# Altium schematic sheet 小板原理图.SchDoc
size 685 x 355 mm; SheetNumber: 0; SheetTotal: 0
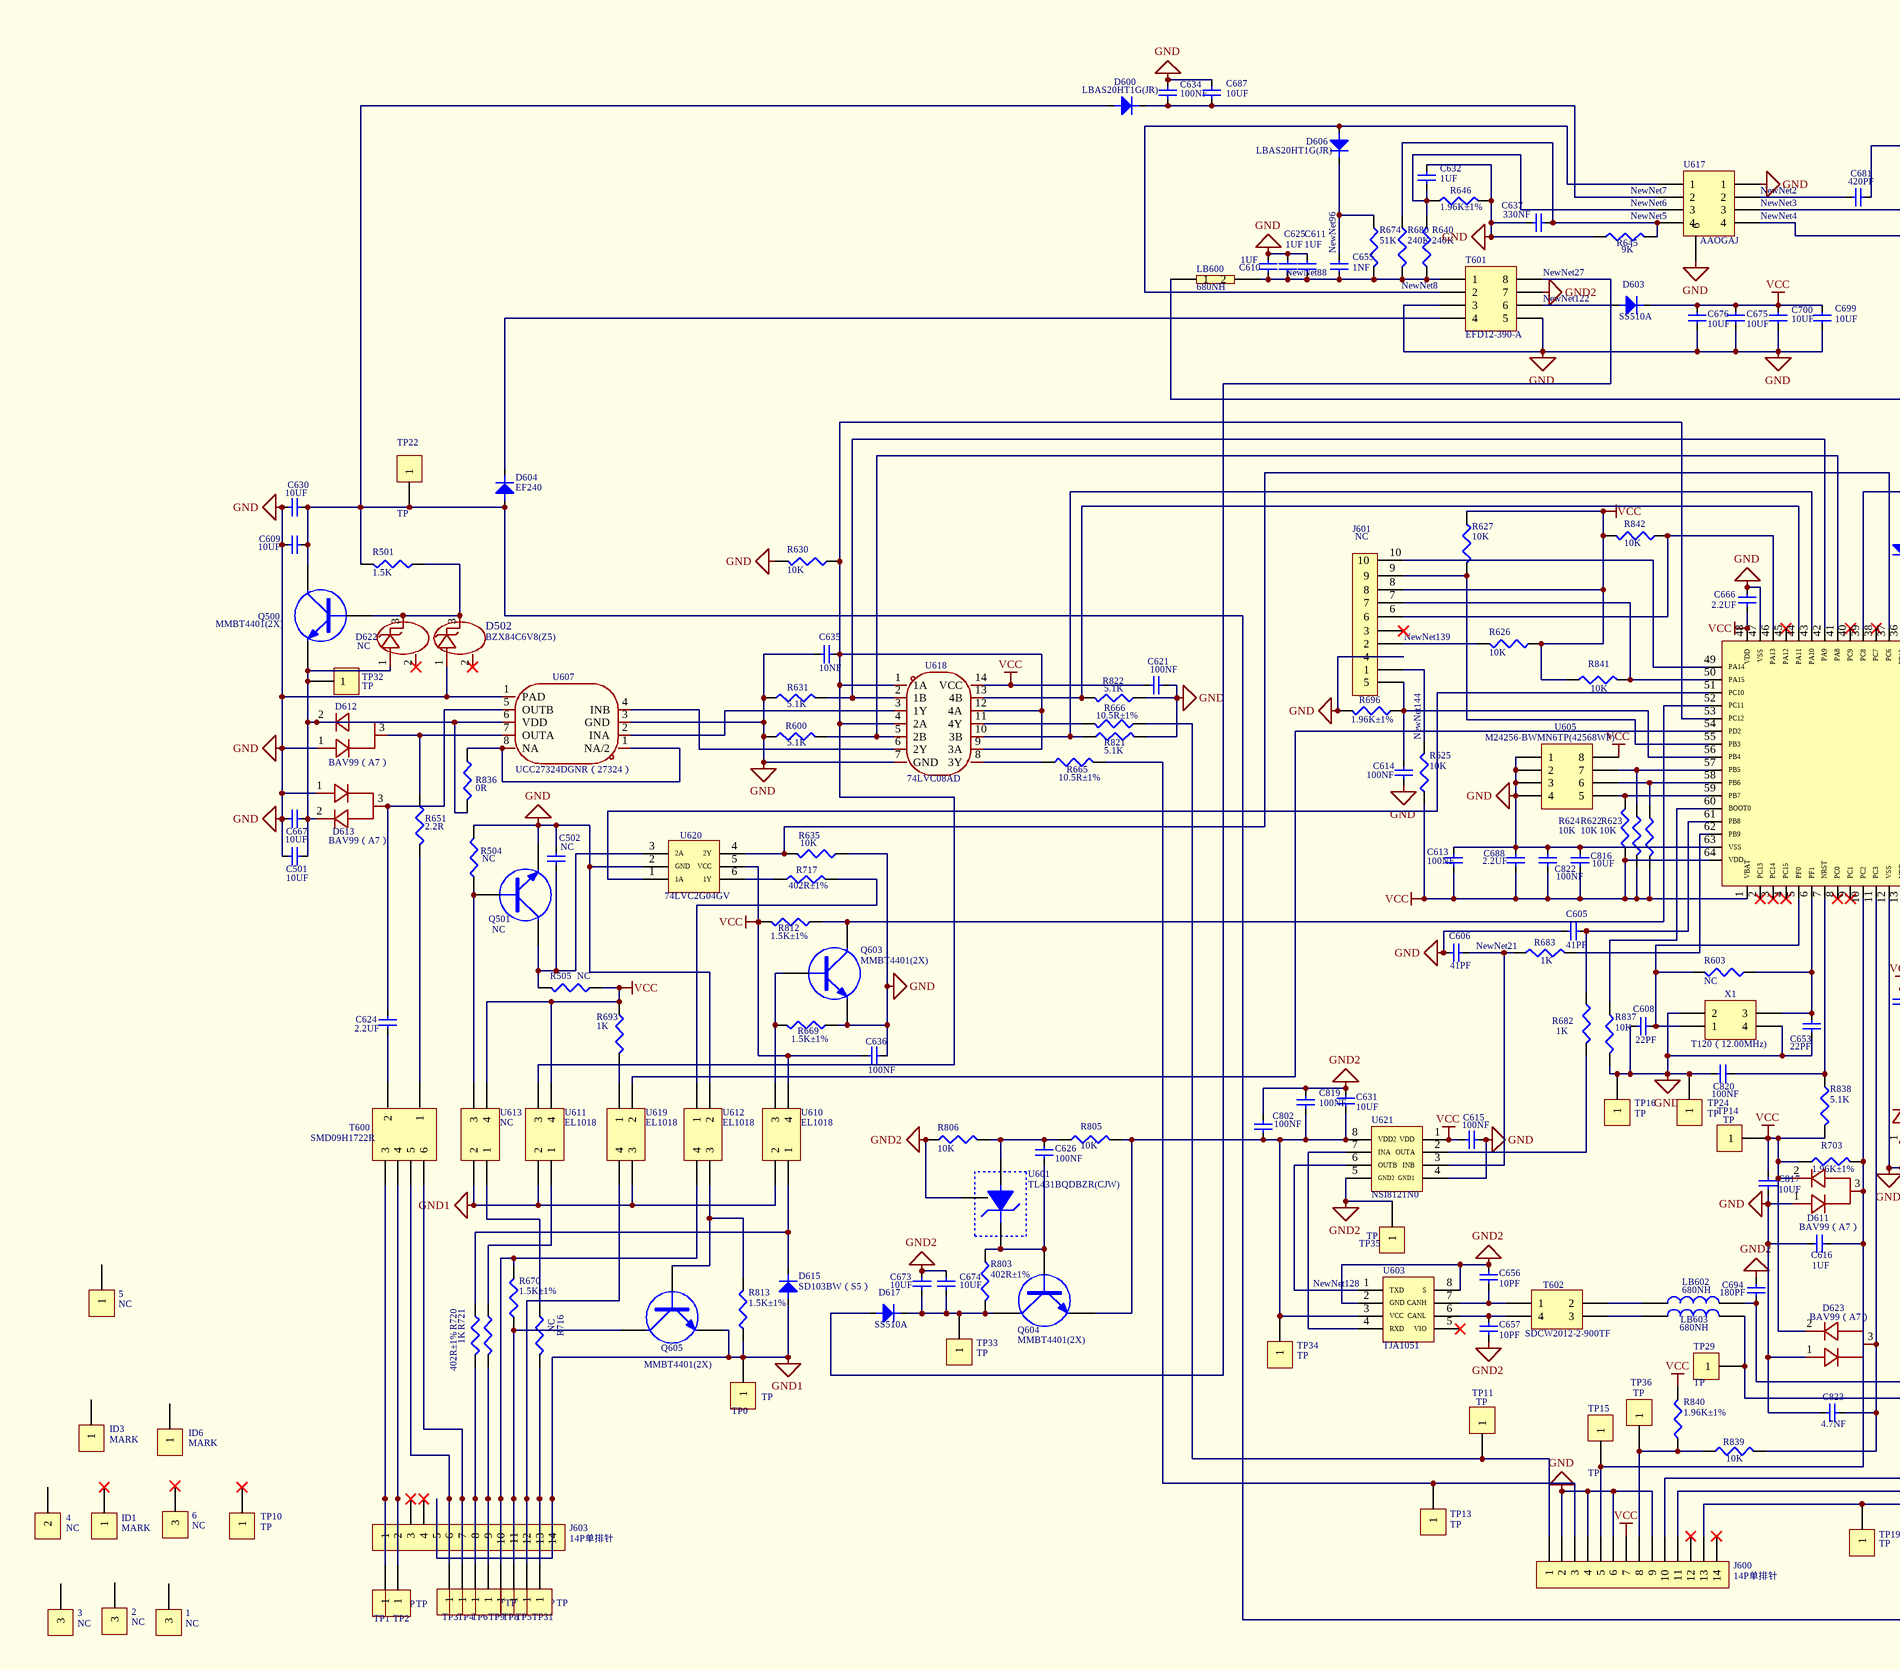
[diagram p0: 小板原理图.SchDoc, left]
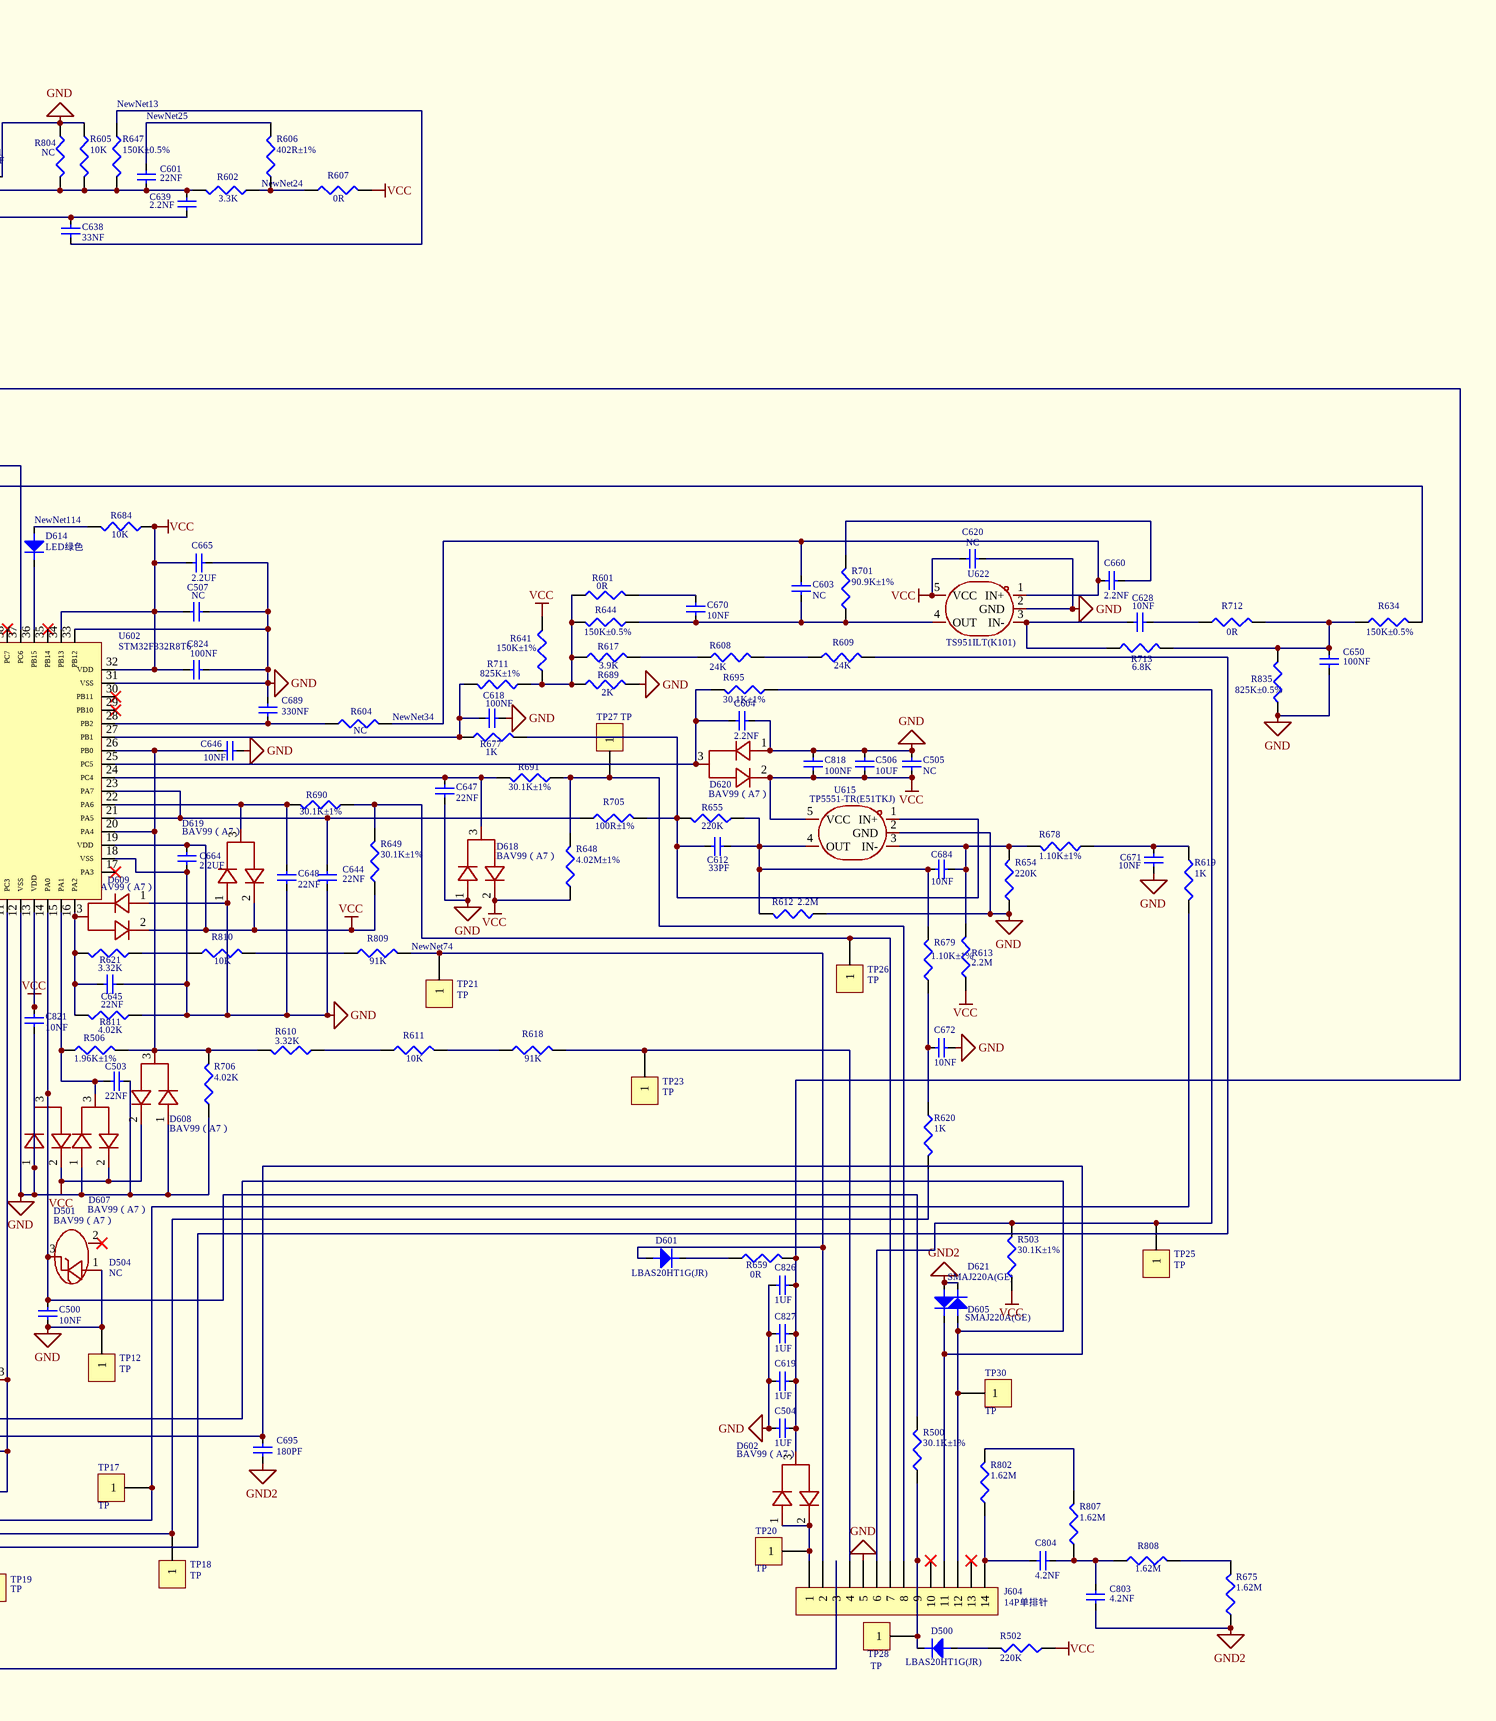
[diagram p1: 小板原理图.SchDoc, right]

## Parts
1  NC  [27]
2  NC  [28]
3  NC  [29]
4  NC  [30]
5  NC  [30]
6  NC  [30]
C500  10NF  [33]
C501  10UF  [4]
C502  NC  [33]
C503  22NF  [33]
C504  1UF  [3]
C505  NC  [3]
C506  10UF  [3]
C507  NC  [3]
C601  22NF  [33]
C603  NC  [33]
C604  2.2NF  [33]
C605  41PF  [33]
C606  41PF  [33]
C608  22PF  [14]
C609  10UF  [4]
C610  1UF  [3]
C611  1UF  [3]
C612  33PF  [33]
C613  100NF  [14]
C614  100NF  [14]
C615  100NF  [14]
C616  1UF  [33]
C618  100NF  [14]
C619  1UF  [32]
C620  NC  [14]
C621  100NF  [14]
C624  2.2UF  [3]
C625  1UF  [3]
C626  100NF  [14]
C628  10NF  [33]
C630  10UF  [4]
C631  10UF  [4]
C632  1UF  [32]
C634  100NF  [33]
C635  10NF  [33]
C636  100NF  [14]
C637  330NF  [32]
C638  33NF  [14]
C639  2.2NF  [33]
C644  22NF  [33]
C645  22NF  [33]
C646  10NF  [33]
C647  22NF  [33]
C648  22NF  [33]
C650  100NF  [33]
C653  22PF  [14]
C655  1NF  [4]
C656  10PF  [33]
C657  10PF  [33]
C660  2.2NF  [33]
C664  2.2UF  [32]
C665  2.2UF  [32]
C666  2.2UF  [32]
C667  10UF  [4]
C670  10NF  [33]
C671  10NF  [33]
C672  10NF  [33]
C673  10UF  [4]
C674  10UF  [4]
C675  10UF  [32]
C676  10UF  [32]
C681  420PF  [33]
C684  10NF  [33]
C687  10UF  [4]
C688  2.2UF  [32]
C689  330NF  [32]
C694  180PF  [33]
C695  180PF  [33]
C699  10UF  [32]
C700  10UF  [32]
C802  100NF  [14]
C803  4.2NF  [4]
C804  4.2NF  [4]
C816  10UF  [32]
C817  10UF  [32]
C818  100NF  [14]
C819  100NF  [14]
C820  100NF  [33]
C821  10NF  [33]
C822  100NF  [14]
C823  4.7NF  [33]
C824  100NF  [14]
C826  1UF  [32]
C827  1UF  [32]
D500  LBAS20HT1G(JR)  [18]
D501  BAV99（A7）  [31]
D502  BZX84C6V8(Z5)  [31]
D504  NC  [31]
D600  LBAS20HT1G(JR)  [18]
D601  LBAS20HT1G(JR)  [18]
D602  BAV99（A7）  [31]
D603  SS510A  [16]
D604  EF240  [17]
D605  SMAJ220A(GE)  [19]
D606  LBAS20HT1G(JR)  [18]
D607  BAV99（A7）  [31]
D608  BAV99（A7）  [31]
D609  BAV99（A7）  [31]
D611  BAV99（A7）  [31]
D612  BAV99（A7）  [31]
D613  BAV99（A7）  [31]
D614  LED绿色  [10]
D615  SD103BW（S5）  [18]
D617  SS510A  [16]
D618  BAV99（A7）  [31]
D619  BAV99（A7）  [31]
D620  BAV99（A7）  [31]
D621  SMAJ220A(GE)  [19]
D622  NC  [31]
D623  BAV99（A7）  [31]
ID1  MARK  [30]
ID3  MARK  [30]
ID6  MARK  [30]
J600  14P单排针  [21]
J601  NC  [25]
J603  14P单排针  [21]
J604  14P单排针  [21]
LB600  680NH  [3]
LB602  680NH  [32]
LB603  680NH  [32]
Q500  MMBT4401(2X)  [31]
Q501  NC  [31]
Q603  MMBT4401(2X)  [31]
Q604  MMBT4401(2X)  [31]
Q605  MMBT4401(2X)  [31]
R500  30.1K±1%  [33]
R501  1.5K  [32]
R502  220K  [33]
R503  30.1K±1%  [33]
R504  NC  [33]
R505  NC  [33]
R506  1.96K±1%  [33]
R600  5.1K  [33]
R601  0R  [33]
R602  3.3K  [33]
R603  NC  [32]
R604  NC  [33]
R605  10K  [33]
R606  402R±1%  [33]
R607  0R  [33]
R608  24K  [32]
R609  24K  [32]
R610  3.32K  [32]
R611  10K  [32]
R612  2.2M  [32]
R613  2.2M  [32]
R617  3.9K  [32]
R618  91K  [32]
R619  1K  [33]
R620  1K  [33]
R621  3.32K  [32]
R622  10K  [33]
R623  10K  [33]
R624  10K  [33]
R625  10K  [33]
R626  10K  [33]
R627  10K  [33]
R630  10K  [33]
R631  5.1K  [33]
R634  150K±0.5%  [33]
R635  10K  [33]
R640  240K  [32]
R641  150K±1%  [33]
R644  150K±0.5%  [33]
R645  9K  [33]
R646  1.96K±1%  [33]
R647  150K±0.5%  [33]
R648  4.02M±1%  [33]
R649  30.1K±1%  [33]
R651  2.2R  [4]
R654  220K  [33]
R655  220K  [33]
R659  0R  [4]
R665  10.5R±1%  [33]
R666  10.5R±1%  [33]
R669  1.5K±1%  [33]
R670  1.5K±1%  [33]
R674  51K  [4]
R675  1.62M  [4]
R677  1K  [33]
R678  1.10K±1%  [33]
R679  1.10K±1%  [33]
R680  240K  [32]
R682  1K  [33]
R683  1K  [33]
R684  10K  [33]
R689  2K  [32]
R690  30.1K±1%  [33]
R691  30.1K±1%  [33]
R693  1K  [33]
R695  30.1K±1%  [33]
R696  1.96K±1%  [33]
R701  90.9K±1%  [33]
R703  1.96K±1%  [33]
R705  100R±1%  [33]
R706  4.02K  [32]
R711  825K±1%  [33]
R712  0R  [33]
R713  6.8K  [33]
R716  NC  [33]
R717  402R±1%  [33]
R720  402R±1%  [33]
R721  1K  [33]
R802  1.62M  [4]
R803  402R±1%  [33]
R804  NC  [33]
R805  10K  [33]
R806  10K  [33]
R807  1.62M  [4]
R808  1.62M  [4]
R809  91K  [32]
R810  10K  [32]
R811  4.02K  [32]
R812  1.5K±1%  [33]
R813  1.5K±1%  [33]
R821  5.1K  [33]
R822  5.1K  [33]
R835  825K±0.5%  [33]
R836  0R  [33]
R837  10K  [33]
R838  5.1K  [33]
R839  10K  [33]
R840  1.96K±1%  [33]
R841  10K  [33]
R842  10K  [33]
T600  SMD09H1722R  [2]
T601  EFD12-390-A  [20]
T602  SDCW2012-2-900TF  [24]
TP0  TP  [35]
TP1  TP  [35]
TP2  TP  [35]
TP3  TP  [35]
TP4  TP  [35]
TP5  TP  [35]
TP6  TP  [35]
TP7  TP  [35]
TP8  TP  [35]
TP9  TP  [35]
TP10  TP  [35]
TP11  TP  [35]
TP12  TP  [35]
TP13  TP  [35]
TP14  TP  [35]
TP15  TP  [35]
TP16  TP  [35]
TP17  TP  [35]
TP18  TP  [35]
TP19  TP  [35]
TP20  TP  [35]
TP21  TP  [35]
TP22  TP  [35]
TP23  TP  [35]
TP24  TP  [35]
TP25  TP  [35]
TP26  TP  [35]
TP27  TP  [35]
TP28  TP  [35]
TP29  TP  [35]
TP30  TP  [35]
TP31  TP  [35]
TP32  TP  [35]
TP33  TP  [35]
TP34  TP  [35]
TP35  TP  [35]
TP36  TP  [35]
U601  TL431BQDBZR(CJW)  [31]
U602  STM32F332R8T6  [11]
U603  TJA1051  [12]
U605  M24256-BWMN6TP(42568WP)  [12]
U607  UCC27324DGNR（27324）  [6]
U610  EL1018  [7]
U611  EL1018  [7]
U612  EL1018  [7]
U613  NC  [7]
U615  TP5551-TR(E51TKJ)  [15]
U617  AAOGAJ  [23]
U618  74LVC08AD  [9]
U619  EL1018  [7]
U620  74LVC2G04GV  [26]
U621  NSI8121N0  [12]
U622  TS951ILT(K101)  [15]
X1  T120（12.00MHz)  [13]

## Nets
GND: C500.1 C501.2 C502.2 C503.1 C504.2 C505.2 C506.2 C507.1 C604.1 C605.2 C606.1 C608.1 C609.1 C610.1 C611.1 C613.1 C614.2 C615.2 C616.2 C618.1 C619.1 C620.1 C621.1 C625.1 C630.1 C632.1 C634.1 C635.2 C636.2 C637.1 C644.2 C645.1 C646.1 C647.1 C648.1 C650.2 C653.1 C664.2 C665.1 C666.2 C667.1 C671.2 C672.2 C675.2 C676.2 C681.2 C687.1 C688.1 C689.1 C699.2 C700.2 C816.1 C817.1 C818.1 C820.2 C821.1 C822.2 C823.1 C824.1 C826.1 C827.1 D501.1 D502.1(A) D504.1(A) D607.1 D608.1 D609.1 D611.1 D612.1 D613.1 D618.1 D619.1 D620.1 D623.1 J600.2 J600.4 J600.6 J600.9 J601.4 J604.5 Q501.2 Q603.2 R504.2 R600.1 R605.1 R612.1 R630.2 R631.1 R635.1 R645.1 R646.2 R654.1 R669.1 R689.2 R696.2 R706.1 R804.1 R811.1 R821.2 R822.1 R835.1 R837.2 T601.3 T601.5 TP12.1 TP16.1 TP24.1 U602.12(VSS) U602.18(VSS) U602.31(VSS) U602.33(PB12) U602.47(VSS) U602.63(VSS) U605.1 U605.2 U605.3 U605.4 U607.1(PAD) U607.3(GND) U612.2 U615.2(GND) U617.1 U617.6 U618.7(GND) U620.2(GND) U621.4(GND1) U622.2(GND) X1.2 X1.4
GND1: D615.2(A) J603.5 J603.14 Q605.2 R813.1 TP0.1 U610.2 U611.2 U613.2 U619.3
GND2: C631.2 C656.2 C657.1 C673.1 C674.1 C694.2 C695.2 C802.1 C803.2 C819.1 D605.1(K) D621.2(A) R675.1 R806.2 T601.7 TP35.1 U601.3(R) U603.2(GND) U603.8(S) U621.5(GND2)
VCC: C505.1 C506.1 C507.2 C613.2 C615.1 C620.2 C621.2 C636.1 C664.1 C665.2 C666.1 C675.1 C676.1 C688.2 C699.1 C700.1 C816.2 C817.2 C818.2 C821.2 C822.1 C824.2 D501.2 D603.1(K) D607.2 D608.2 D609.2 D611.2 D618.2 D619.2 D620.2 D623.2 J600.7 J601.8 R502.1 R503.1 R505.1 R607.2 R613.1 R622.2 R623.2 R624.1 R625.1 R626.1 R627.1 R641.2 R648.1 R649.1 R684.1 R693.1 R703.1 R812.2 R838.2 R840.2 R841.1 R842.2 TP14.1 U602.1(VBAT) U602.13(VDD) U602.19(VDD) U602.32(VDD) U602.34(PB13) U602.48(VDD) U602.64(VDD) U605.8 U610.4 U611.4 U613.4 U615.5(VCC) U618.14(VCC) U620.5(VCC) U621.1(VDD) U622.5(VCC)
NewNet2: C681.1 U617.2
NewNet3: C601.2 C639.2 R602.2 R605.2 R647.2 R804.2 U617.3
NewNet4: C638.2 C639.1 U617.4
NewNet5: C637.2 R645.2 R680.1 U617.4
NewNet6: C632.2 R640.2 R646.1 U617.3
NewNet7: C634.2 C687.2 D600.1(K) U617.2
NewNet8: D606.2(A) T601.2 U617.1
NewNet13: C638.1 R647.1
NewNet21: C606.2 R683.1 U621.3(INB)
NewNet24: R602.1 R606.1 R607.1
NewNet25: C601.1 R606.2
NewNet27: D617.2(A) T601.8
NewNet34: C603.2 C660.2 R604.2 U622.1(IN+)
NewNet74: D601.2(A) J604.2 R809.2 TP21.1
NewNet88: C610.2 C611.2 C625.2 C655.2 LB600.2 R640.1 R674.2 R680.2 T601.1
NewNet96: C655.1 D606.1(K) R674.1
NewNet114: D614.2(A) R684.2
NewNet122: D603.2(A) T601.6
NewNet128: U603.1(TXD) U621.6(OUTB)
NewNet139: J601.2 R626.2
NewNet144: J601.1 R625.2
NetC500_2: C500.2 D501.3 D504.3(K) R500.2 U602.14(PA0)
NetC501_1: C501.1 C667.2 D612.2 D613.2 D622.1(A) Q500.2 R836.2 TP32.1 U607.6(VDD)
NetC502_1: C502.1 Q501.3 R505.2 U620.3(2A)
NetC503_2: C503.2 D607.3 R506.1 U602.15(PA1)
NetC504_1: C504.1 C619.2 C826.2 C827.2 D602.3 LB600.1 R659.2
NetC603_1: C603.1 C670.1 R644.1 R701.1 U622.4(OUT)
NetC604_2: C604.2 D620.3 R695.2 U602.25(PC5)
NetC605_1: C605.1 R682.1 U602.61(PB8)
NetC608_2: C608.2 R603.2 U602.5(PF0) X1.1
NetC609_2: C609.2 C630.2 D600.2(A) D604.2(A) J604.3 Q500.3 R501.2 TP22.1
NetC612_1: C612.1 C684.2 R612.2 R655.1 R679.2 U615.4(OUT)
NetC612_2: C612.2 R655.2 R677.2 R705.2 U615.1(IN+)
NetC614_1: C614.1 J601.5 R696.1 U602.56(PB4)
NetC616_1: C616.1 D611.3 J600.5 R703.2 TP15.1 U602.10(PC2)
NetC618_2: C618.2 R677.1 R711.2 U602.27(PB1)
NetC624_1: C624.1 D613.3 U607.5(OUTB)
NetC624_2: C624.2 T600.2
NetC626_1: C626.1 R805.2 R806.1 U601.2(A)
NetC626_2: C626.2 Q604.1 R803.1 U601.1(K)
NetC628_1: C628.1 R713.1 U622.3(IN-)
NetC628_2: C628.2 R712.1
NetC631_1: C631.1 C802.2 C819.2 Q604.2 R805.1 TP34.1 U603.3(VCC) U621.8(VDD2)
NetC635_1: C635.1 R630.1 U602.53(PC12) U611.3 U618.1(1A) U618.4(2A) U618.9(3A) U618.12(4A)
NetC644_1: C644.1 R705.1 U602.21(PA5) U602.23(PA7)
NetC645_2: C645.2 D609.3 R621.2 R811.2 U602.16(PA2)
NetC646_2: C646.2 D608.3 R506.2 R610.2 R706.2 U602.20(PA4) U602.26(PB0)
NetC647_2: C647.2 D618.3 R691.2 U602.24(PC4)
NetC648_2: C648.2 D619.3 R690.2 U602.22(PA6)
NetC650_1: C650.1 R634.1 R712.2 R713.2 R835.2
NetC653_2: C653.2 R603.1 U602.6(PF1) X1.3
NetC656_1: C656.1 T602.1 U603.7(CANH)
NetC657_2: C657.2 T602.4 U603.6(CANL)
NetC660_1: C660.1 R701.2
NetC670_2: C670.2 R601.2
NetC671_1: C671.1 R619.1 R678.1
NetC672_1: C672.1 R620.1 R679.1
NetC673_2: C673.2 C674.2 D617.1(K) Q604.3 R803.2 TP33.1
NetC684_1: C684.1 R613.2 R654.2 R678.2 U615.3(IN-)
NetC689_2: C689.2 R604.1 U602.28(PB2)
NetC694_1: C694.1 D605.2(A) J604.12 LB602.1 TP30.1
NetC695_1: C695.1 D621.1(K) J604.11 LB603.1 TP29.1
NetC803_1: C803.1 C804.2 R807.1 R808.1
NetC804_1: C804.1 J604.14 R802.1
NetC820_1: C820.1 R838.1 U602.7(NRST)
NetC823_2: C823.2 D623.3 R839.2 U602.11(PC3)
NetD500_1: D500.1(K) J604.9 R500.1 TP28.1
NetD500_2: D500.2(A) R502.2
NetD502_3: D502.3(K) D622.3(K) Q500.1 R501.1
NetD601_1: D601.1(K) R659.1
NetD602_1: D602.1 D602.2 J604.1 TP20.1
NetD604_1: D604.1(K) T601.4
NetD612_3: D612.3 R651.1 U607.7(OUTA)
NetD614_1: D614.1(K) U602.36(PB15)
NetD615_1: D615.1(K) R720.1 U610.1
NetJ600_1: J600.1 R666.1 TP11.1
NetJ600_3: J600.3 R665.2 TP13.1
NetJ600_8: J600.8 R839.1 R840.1 TP36.1
NetJ600_10: J600.10 R619.2 TP17.1
NetJ600_11: J600.11 R620.2 TP18.1
NetJ600_13: J600.13 R609.2 TP19.1
NetJ601_6: J601.6 R842.1 U602.46(PA13)
NetJ601_7: J601.7 R841.2 U602.50(PA15)
NetJ601_9: J601.9 R627.2 U602.55(PB3)
NetJ601_10: J601.10 U602.49(PA14)
NetJ603_1: J603.1 T600.3 TP1.1
NetJ603_2: J603.2 T600.4 TP2.1
NetJ603_6: J603.6 T600.5 TP3.1
NetJ603_7: J603.7 T600.6 TP4.1
NetJ603_8: J603.8 R720.2 TP6.1
NetJ603_9: J603.9 R721.2 TP9.1
NetJ603_10: J603.10 R670.2 TP7.1 U612.4
NetJ603_11: J603.11 Q605.3 R670.1 TP8.1
NetJ603_12: J603.12 TP5.1 U619.4
NetJ603_13: J603.13 R716.2 TP31.1
NetJ604_4: J604.4 R618.2 TP23.1
NetJ604_6: J604.6 R503.2 R695.1 TP25.1
NetJ604_7: J604.7 R649.2 R690.1 TP26.1
NetJ604_8: J604.8 R648.2 R691.1 TP27.1
NetLB602_2: LB602.2 T602.2
NetLB603_2: LB603.2 T602.3
NetQ501_1: Q501.1 R504.1 U613.3
NetQ603_1: Q603.1 R669.2 U610.3
NetQ603_3: Q603.3 R812.1 U602.52(PC11)
NetQ605_1: Q605.1 R813.2 U612.3
NetR600_2: R600.2 U602.41(PA8) U618.5(2B)
NetR601_1: R601.1 R617.1 R641.1 R644.2 R689.1 R711.1
NetR608_1: R608.1 R617.2
NetR608_2: R608.2 R609.1
NetR610_1: R610.1 R611.1
NetR611_2: R611.2 R618.1
NetR621_1: R621.1 R810.1
NetR622_1: R622.1 U602.57(PB5) U605.7
NetR623_1: R623.1 U602.58(PB6) U605.6
NetR624_2: R624.2 U602.59(PB7) U605.5
NetR631_2: R631.2 U602.42(PA9) U618.2(1B)
NetR634_2: R634.2 U602.39(PC8)
NetR635_2: R635.2 U602.37(PC6) U620.4(2Y)
NetR651_2: R651.2 T600.1
NetR665_1: R665.1 U618.8(3Y)
NetR666_2: R666.2 U618.11(4Y)
NetR675_2: R675.2 R808.2
NetR682_2: R682.2 U621.2(OUTA)
NetR683_2: R683.2 U602.62(PB9)
NetR693_2: R693.2 U619.1
NetR716_1: R716.1 U613.1
NetR717_1: R717.1 U620.6(1Y)
NetR717_2: R717.2 U612.1
NetR721_1: R721.1 U611.1
NetR802_2: R802.2 R807.2
NetR809_1: R809.1 R810.2
NetR821_1: R821.1 U602.43(PA10) U618.10(3B)
NetR822_2: R822.2 U602.44(PA11) U618.13(4B)
NetR836_1: R836.1 U607.1(NA/2) U607.8(NA)
NetR837_1: R837.1 U602.60(BOOT0)
NetU602_51: U602.51(PC10) U620.1(1A)
NetU602_54: U602.54(PD2) U619.2
NetU603_4: U603.4(RXD) U621.7(INA)
NetU607_2: U607.2(INA) U618.3(1Y)
NetU607_4: U607.4(INB) U618.6(2Y)

Not connected (* = marked no-connect by the designer): 1 3; 2 3; 3 3; 4 2; 5 1; 6 3*; D502 2*; D504 2*; D622 2*; ID1 1*; ID3 1; ID6 1; J600 12* 14*; J601 3*; J603 3* 4*; J604 10* 13*; TP10 1*; U602 2(PC13)* 3(PC14)* 4(PC15)* 8(PC0)* 9(PC1)* 17(PA3)* 29(PB10)* 30(PB11)* 35(PB14)* 38(PC7)* 40(PC9)* 45(PA12)*; U603 5(VIO)*

## Library data of the parts
1-6 J601 U603 U610-U613 U619-U621 = NC_
C500-C507 C601 C603-C606 C608-C616 C618-C621 C624-C626 C628 C630-C632 C634-C639 C644-C648 C650 C653 C655-C657 C660 C664-C667 C670-C676 C681 C684 C687-C689 C694 C695 C699 C700 C802-C804 C816-C824 C826 C827 = CAP: Capacitor
D500 D600 D601 D603-D606 D614 D615 D617 D621 = DIODE_SMD: Diode
D501 D602 D607-D609 D611-D613 D618-D620 D623 = BAV99_C7420336
D502 D504 D622 = BZX84-C6V2
ID1 ID3 ID6 = MARK_
J600 J603 J604 = 14P单排针 _
LB600 = 680NH_
LB602 LB603 = INDUCTOR1
Q500 Q501 Q603-Q605 = NPN
R500-R506 R600-R613 R617-R627 R630 R631 R634 R635 R640 R641 R644-R649 R651 R654 R655 R659 R665 R666 R669 R670 R674 R675 R677-R680 R682-R684 R689-R691 R693 R695 R696 R701 R703 R705 R706 R711-R713 R716 R717 R720 R721 R802-R813 R821 R822 R835-R842 = RES1
T600 = SMD09H1722R_
T601 = EFD12-390-A_
T602 = SDCW2012-2-900TF_
TP0-TP36 = TP_
U601 = TL431AC: Schottky Diode
U602 = NC__1
U605 = M24256-BWMN6TP(42568WP)_
U607 = UCC27324DGNR
U615 U622 = RY3421-sot23-6
U617 = AAOGAJ_
U618 = SN74LVC08ADR
X1 = T120（12.00MHz)_